# Altium project VXR7200_Bridge.PrjPcb (part 1 of 2)
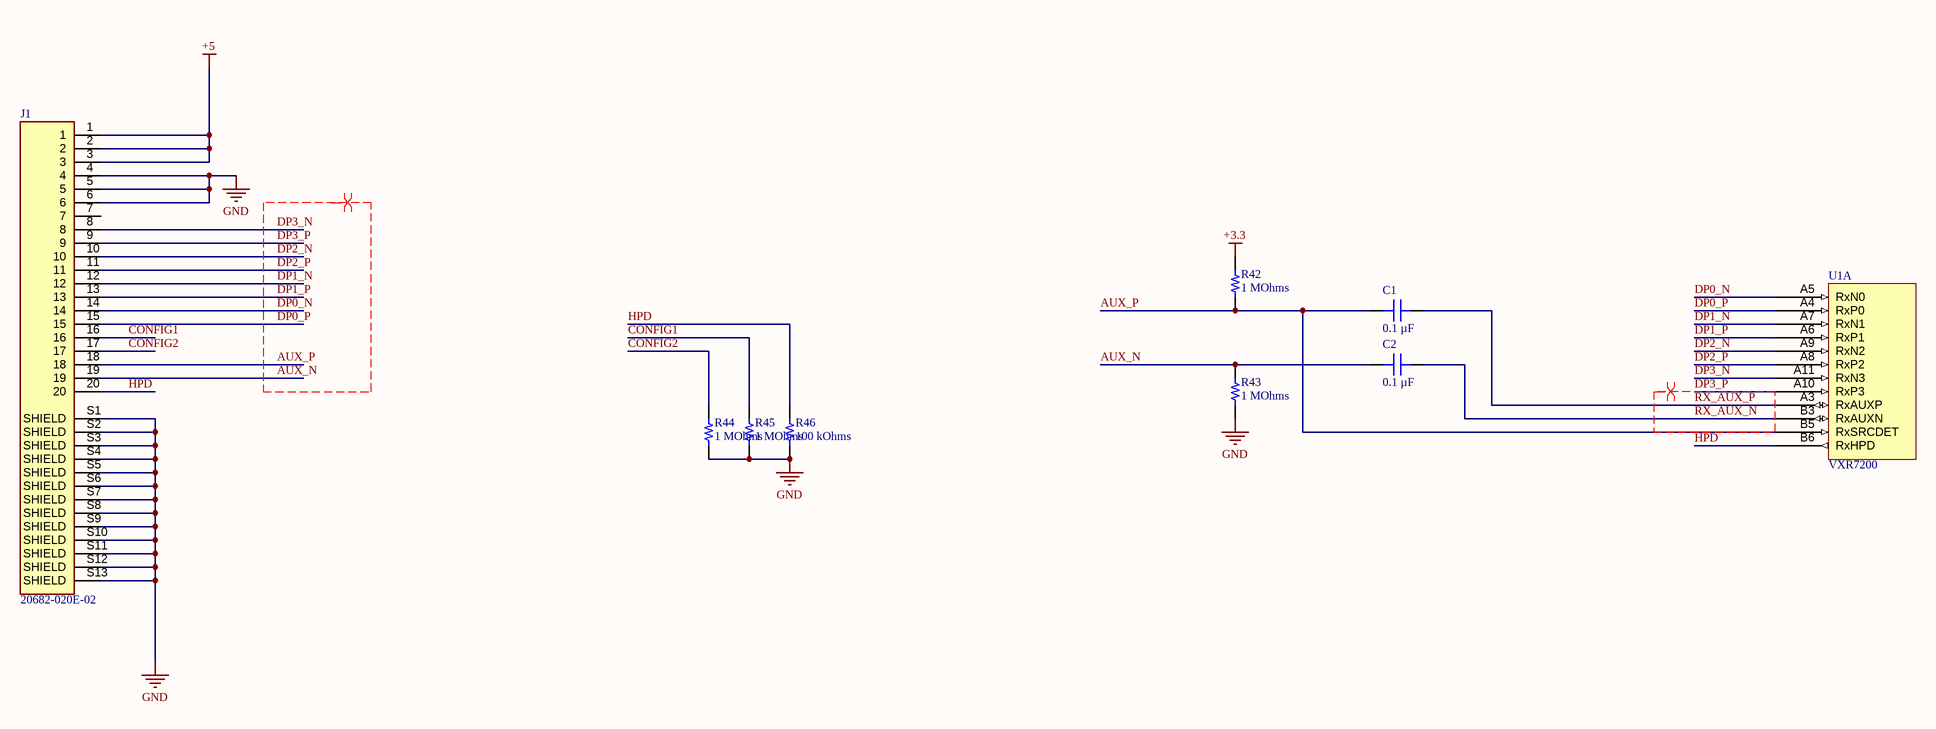
[diagram p0: RX_DP.SchDoc]
8 sheets, 118 parts. Net scope: flat (ports and power ports of the same name join across sheets).
Board file: PCB.PcbDoc
Sheets:
  RX_DP.SchDoc
  TX0.SchDoc
  TX1.SchDoc
  PDN.SchDoc
  Control.SchDoc
  Supplies_LTM4643.SchDoc
  Misc.SchDoc
  MCUConn.SchDoc

## Sheet RX_DP.SchDoc
size 431 x 279 mm; Organization: ORGANIZATION; Address1: ADDRESS 1; Address2: ADDRESS 2; Address3: ADDRESS 3; Address4: ADDRESS 4; Revision: -; SheetNumber: 1; SheetTotal: 8; ENG_APP_DATE: --/--/--; DSN_APP_DATE: --/--/--; CHK_APP_DATE: --/--/--

### Parts
C1  0.1 µF  [CAP 0201_0603]
C2  0.1 µF  [CAP 0201_0603]
J1  20682-020E-02  [IPEX_20682-020E-02]
R42  1 MOhms  [RES 0201_0603]
R43  1 MOhms  [RES 0201_0603]
R44  1 MOhms  [RES 0201_0603]
R45  1 MOhms  [RES 0201_0603]
R46  100 kOhms  [RES 0201_0603]
U1  VXR7200  [BGA100P9X9-81A]  (part A of 9)

### Nets
+3.3: R42.2
+5: J1.1 J1.2 J1.3
GND: J1.4 J1.5 J1.6 J1.S1(SHIELD) J1.S2(SHIELD) J1.S3(SHIELD) J1.S4(SHIELD) J1.S5(SHIELD) J1.S6(SHIELD) J1.S7(SHIELD) J1.S8(SHIELD) J1.S9(SHIELD) J1.S10(SHIELD) J1.S11(SHIELD) J1.S12(SHIELD) J1.S13(SHIELD) R43.1 R44.1 R45.1 R46.1
AUX_N: C2.1 J1.19 R43.2
AUX_P: C1.1 J1.18 R42.1 U1.B5(RxSRCDET)
CONFIG1: J1.16 R45.2
CONFIG2: J1.17 R44.2
DP0_N: J1.14 U1.A5(RxN0)
DP0_P: J1.15 U1.A4(RxP0)
DP1_N: J1.12 U1.A7(RxN1)
DP1_P: J1.13 U1.A6(RxP1)
DP2_N: J1.10 U1.A9(RxN2)
DP2_P: J1.11 U1.A8(RxP2)
DP3_N: J1.8 U1.A11(RxN3)
DP3_P: J1.9 U1.A10(RxP3)
HPD: J1.20 R46.2 U1.B6(RxHPD)
RX_AUX_N: C2.2 U1.B3(RxAUXN)
RX_AUX_P: C1.2 U1.A3(RxAUXP)

Not connected (* = marked no-connect by the designer): J1 7

### Layout directives
differential pair; net class DP; differential pair class DP: AUX_N, AUX_P, DP0_N, DP0_P, DP1_N, DP1_P, DP2_N, DP2_P, DP3_N, DP3_P, RX_AUX_N, RX_AUX_P

### Notes on the sheet
- DWG. NO.
- REV.
- SHT.
- REVISION
- DESCRIPTION
- DATE
- APPROVED
- ENG:
- APPROVALS
- PROJECT
- DSN:
- CHK:
- REFERENCE DOCUMENTS
- PROJECT REVISION:
- TITLE
- SimulaVR
- DOCUMENT REVISION:
- DESIGN ITEM:
- BOM:
- FAB DWG:
- PCB DWG:
- ASSY DWG:
- SCALE:
- SIZE
- B
- CAGE CODE
- FILE NAME
- DWG NO.
- SHEET
- OF
- REV

### Library data of the parts
C1 C2 = GRM033R61E104KE14D: CAP CER 0.1UF 25V X5R 0201; manufacturer: Murata Electronics; Tolerance: ±10%; Part Number: GRM033R61E104KE14D; Value: 0.1 µF; Applications: General Purpose; Capacitance: 0.1 µF; componentlink1description: Datasheet; componentlink1url: https://search.murata.co.jp/Ceramy/image/img/A01X/G101/ENG/GRM033R61E104KE14-01.pdf; componentlink2description: DigiKey Link; componentlink2url: https://www.digikey.com/en/products/detail/murata-electronics/GRM033R61E104KE14D/4904731; Device Package: 0201 (0603 Metric); lastupdated: 5/20/2022 2:33:00 PM; Lifecycle Status: Active; Minimum Order: 1; Mounting Type: Surface Mount; Operating Temperature: -55°C ~ 85°C; Package / Case: 0201 (0603 Metric); packaging: TapeAndReel; partid: 39731; Part Status: Active; price: 0.01; series: GRM; Size / Dimension: 0.024" L x 0.012" W (0.60mm x 0.30mm); Supplier 1: DigiKey; Supplier Part Number 1: 490-12686-1-ND; Temperature Coefficient: X5R; Thickness (Max): 0.013" (0.33mm); Voltage - Rated: 25V
J1 = 20682-020E-02: Cabline-CAII Rece. Ass'y; MF: {'manufacturer': u'I-PEX'}; Package: None; Price: None; MP: 20682-020E-02; Availability: Unavailable; Value: *
R42-R45 = CRCW02011M00FKED: RES SMD 1M OHM 1% 1/20W 0201; Manufacturer: Vishay Dale; Power (Watts): 0.05W, 1/20W; Temperature Coefficient: ±100ppm/°C; Part Number: CRCW02011M00FKED; Value: 1 MOhms; ComponentLink1Description: Datasheet; ComponentLink1URL: http://www.vishay.com/docs/20052/crcw0201e3.pdf; ComponentLink2Description: DigiKey Link; ComponentLink2URL: https://www.digikey.com/en/products/detail/vishay-dale/CRCW02011M00FKED/1968003; Composition: Thick Film; Device Package: 0201 (0603 Metric); Height - Seated (Max): 0.010" (0.26mm); LastUpdated: 2022-04-12 22:16:01; Lifecycle Status: Active; Minimum Order: 1; Number of Terminations: 2; Operating Temperature: -55°C ~ 155°C; Package / Case: 0201 (0603 Metric); Packaging: TapeAndReel; PartId: 30; Part Status: Active; Price: 0.03; Resistance: 1 MOhms; Series: CRCW; Size / Dimension: 0.024" L x 0.012" W (0.60mm x 0.30mm); Supplier 1: DigiKey; Supplier Part Number 1: 541-1.00MAABCT-ND; Supplier Device Package: 0201; Tolerance: ±1%
R46 = ERJ-U01F1003C: RES 100K OHM 1% 1/20W 0201 SMD; Manufacturer: Panasonic Electronic Components; Power (Watts): 0.05W, 1/20W; Temperature Coefficient: ±200ppm/°C; Part Number: ERJ-U01F1003C; Value: 100 kOhms; ComponentLink1Description: Datasheet; ComponentLink1URL: https://industrial.panasonic.com/cdbs/www-data/pdf/RDP0000/AOA0000C334.pdf; ComponentLink2Description: DigiKey Link; ComponentLink2URL: https://www.digikey.com/en/products/detail/panasonic-electronic-components/ERJ-U01F1003C/11631500; Composition: Thick Film; Device Package: 0201 (0603 Metric); Features: Anti-Sulfur; Height - Seated (Max): 0.010" (0.26mm); LastUpdated: 2022-04-12 22:15:26; Lifecycle Status: Active; Minimum Order: 1; Number of Terminations: 2; Operating Temperature: -55°C ~ 125°C; Package / Case: 0201 (0603 Metric); Packaging: TapeAndReel; PartId: 64617; Part Status: Active; Price: 0.05; Resistance: 100 kOhms; Series: ERJ-U01; Size / Dimension: 0.024" L x 0.012" W (0.60mm x 0.30mm); Supplier 1: DigiKey; Supplier Part Number 1: 10-ERJ-U01F1003CCT-ND; Supplier Device Package: 0201; Tolerance: ±1%
U1 = CMP-015-00008-4: VXR7200 DP to MIPI-DSI bridge

## Sheet TX0.SchDoc
size 431 x 279 mm; Organization: ORGANIZATION; Address1: ADDRESS 1; Address2: ADDRESS 2; Address3: ADDRESS 3; Address4: ADDRESS 4; Revision: -; SheetNumber: 2; SheetTotal: 8; ENG_APP_DATE: --/--/--; DSN_APP_DATE: --/--/--; CHK_APP_DATE: --/--/--
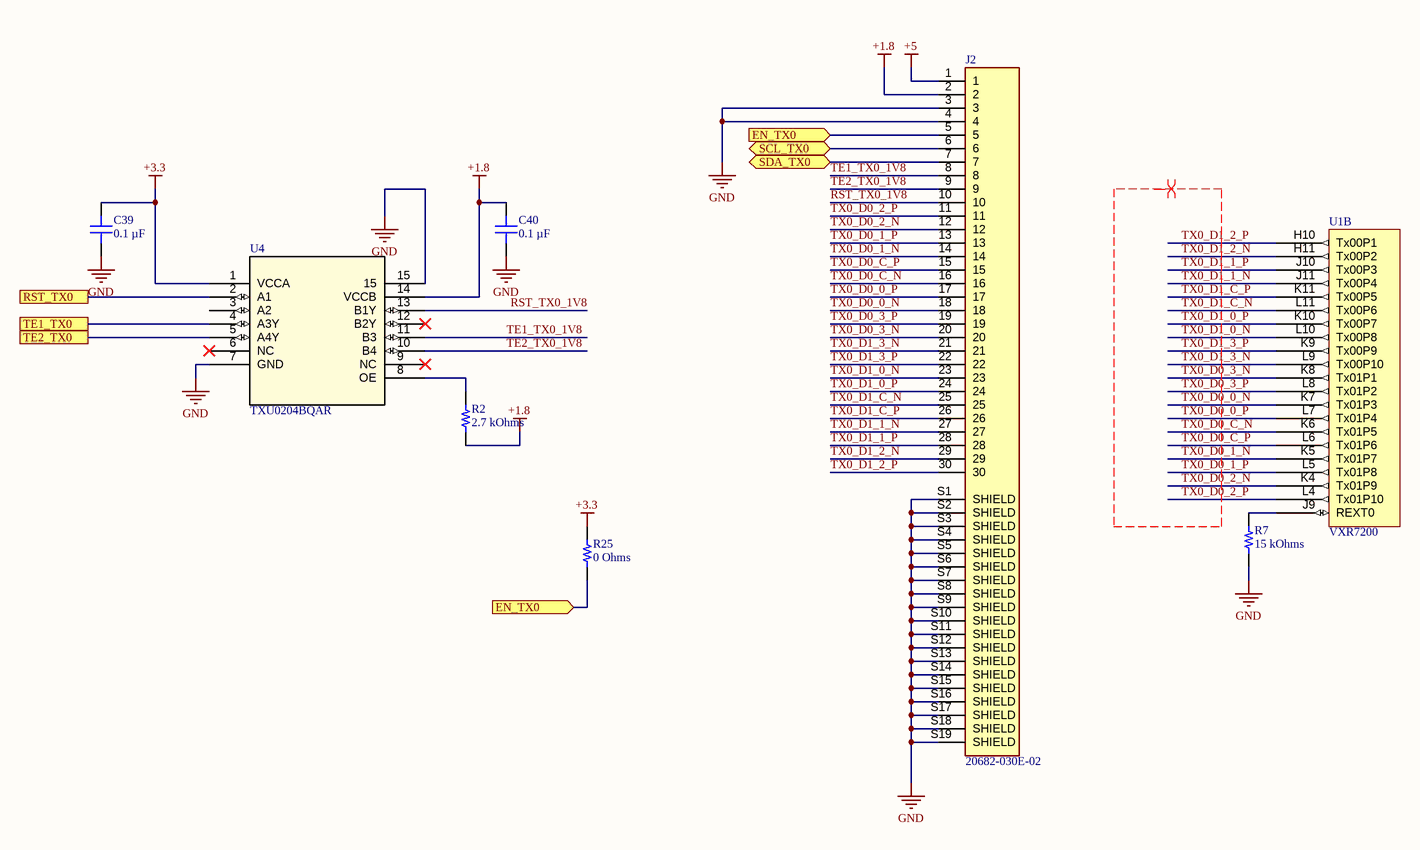
[diagram p1: TX0.SchDoc]

### Parts
C39  0.1 µF  [CAP 0201_0603]
C40  0.1 µF  [CAP 0201_0603]
J2  20682-030E-02  [IPEX_20682-030E-02]
R2  2.7 kOhms  [RES 0201_0603]
R7  15 kOhms  [RES 0201_0603]
R25  0 Ohms  [RES 0402_1005]
U1  VXR7200  [BGA100P9X9-81A]  (part B of 9)
U4  TXU0204BQAR  [WQFN_04BQAR_TEX]

### Ports
EN_TX0 (in), RST_TX0, SCL_TX0 (bidir), SDA_TX0 (bidir), TE1_TX0, TE2_TX0

### Nets
+1.8: C40.2 J2.2 R2.1 U4.14(VCCB)
+3.3: C39.2 R25.2 U4.1(VCCA)
+5: J2.1
GND: C39.1 C40.1 J2.3 J2.4 J2.S1(SHIELD) J2.S2(SHIELD) J2.S3(SHIELD) J2.S4(SHIELD) J2.S5(SHIELD) J2.S6(SHIELD) J2.S7(SHIELD) J2.S8(SHIELD) J2.S9(SHIELD) J2.S10(SHIELD) J2.S11(SHIELD) J2.S12(SHIELD) J2.S13(SHIELD) J2.S14(SHIELD) J2.S15(SHIELD) J2.S16(SHIELD) J2.S17(SHIELD) J2.S18(SHIELD) J2.S19(SHIELD) R7.1 U4.7(GND) U4.15
EN_TX0: J2.5 R25.1 ; port EN_TX0
RST_TX0: U4.2(A1) ; port RST_TX0
RST_TX0_1V8: J2.10 U4.13(B1Y)
SCL_TX0: J2.6 ; port SCL_TX0
SDA_TX0: J2.7 ; port SDA_TX0
TE1_TX0: U4.4(A3Y) ; port TE1_TX0
TE1_TX0_1V8: J2.8 U4.11(B3)
TE2_TX0: U4.5(A4Y) ; port TE2_TX0
TE2_TX0_1V8: J2.9 U4.10(B4)
TX0_D0_0_N: J2.18 U1.K7(Tx01P3)
TX0_D0_0_P: J2.17 U1.L7(Tx01P4)
TX0_D0_1_N: J2.14 U1.K5(Tx01P7)
TX0_D0_1_P: J2.13 U1.L5(Tx01P8)
TX0_D0_2_N: J2.12 U1.K4(Tx01P9)
TX0_D0_2_P: J2.11 U1.L4(Tx01P10)
TX0_D0_3_N: J2.20 U1.K8(Tx01P1)
TX0_D0_3_P: J2.19 U1.L8(Tx01P2)
TX0_D0_C_N: J2.16 U1.K6(Tx01P5)
TX0_D0_C_P: J2.15 U1.L6(Tx01P6)
TX0_D1_0_N: J2.23 U1.L10(Tx00P8)
TX0_D1_0_P: J2.24 U1.K10(Tx00P7)
TX0_D1_1_N: J2.27 U1.J11(Tx00P4)
TX0_D1_1_P: J2.28 U1.J10(Tx00P3)
TX0_D1_2_N: J2.29 U1.H11(Tx00P2)
TX0_D1_2_P: J2.30 U1.H10(Tx00P1)
TX0_D1_3_N: J2.21 U1.L9(Tx00P10)
TX0_D1_3_P: J2.22 U1.K9(Tx00P9)
TX0_D1_C_N: J2.25 U1.L11(Tx00P6)
TX0_D1_C_P: J2.26 U1.K11(Tx00P5)
NetR2_2: R2.2 U4.8(OE)
NetR7_2: R7.2 U1.J9(REXT0)

Not connected (* = marked no-connect by the designer): U4 3(A2) 6(NC)* 9(NC)* 12(B2Y)*

### Layout directives
differential pair; net class MIPI; differential pair class MIPI: TX0_D0_0_N, TX0_D0_0_P, TX0_D0_1_N, TX0_D0_1_P, TX0_D0_2_N, TX0_D0_2_P, TX0_D0_3_N, TX0_D0_3_P, TX0_D0_C_N, TX0_D0_C_P, TX0_D1_0_N, TX0_D1_0_P, TX0_D1_1_N, TX0_D1_1_P, TX0_D1_2_N, TX0_D1_2_P, TX0_D1_3_N, TX0_D1_3_P, TX0_D1_C_N, TX0_D1_C_P

### Notes on the sheet
- DWG. NO.
- REV.
- SHT.
- REVISION
- DESCRIPTION
- DATE
- APPROVED
- ENG:
- APPROVALS
- PROJECT
- DSN:
- CHK:
- REFERENCE DOCUMENTS
- PROJECT REVISION:
- TITLE
- SimulaVR
- DOCUMENT REVISION:
- DESIGN ITEM:
- BOM:
- FAB DWG:
- PCB DWG:
- ASSY DWG:
- SCALE:
- SIZE
- B
- CAGE CODE
- FILE NAME
- DWG NO.
- SHEET
- OF
- REV

### Library data of the parts
C39 C40 = GRM033R61E104KE14D: as C1 on sheet RX_DP; Part Number: GRM033R61E104KE14D; Value: 0.1 µF; Applications: General Purpose; Capacitance: 0.1 µF; componentlink1description: Datasheet; componentlink1url: https://search.murata.co.jp/Ceramy/image/img/A01X/G101/ENG/GRM033R61E104KE14-01.pdf; componentlink2description: DigiKey Link; componentlink2url: https://www.digikey.com/en/products/detail/murata-electronics/GRM033R61E104KE14D/4904731; Device Package: 0201 (0603 Metric); lastupdated: 5/20/2022 2:33:00 PM; Lifecycle Status: Active; Minimum Order: 1; Mounting Type: Surface Mount; Operating Temperature: -55°C ~ 85°C; Package / Case: 0201 (0603 Metric); packaging: TapeAndReel; partid: 39731; Part Status: Active; price: 0.01; series: GRM; Size / Dimension: 0.024" L x 0.012" W (0.60mm x 0.30mm); Supplier 1: DigiKey; Supplier Part Number 1: 490-12686-1-ND; Temperature Coefficient: X5R; Thickness (Max): 0.013" (0.33mm); Voltage - Rated: 25V
J2 = 20682-030E-02: Cabline-CAII Rece. Ass'y; MF: {'manufacturer': u'I-PEX'}; Value: *; Availability: Unavailable; Price: None; Package: None; MP: 20682-030E-02
R2 = ERJ-U01J272C: RES 2.7K OHM 5% 1/20W 0201 SMD; Manufacturer: Panasonic Electronic Components; Power (Watts): 0.05W, 1/20W; Temperature Coefficient: ±200ppm/°C; Part Number: ERJ-U01J272C; Value: 2.7 kOhms; ComponentLink1Description: Datasheet; ComponentLink1URL: https://industrial.panasonic.com/cdbs/www-data/pdf/RDP0000/AOA0000C334.pdf; ComponentLink2Description: DigiKey Link; ComponentLink2URL: https://www.digikey.com/en/products/detail/panasonic-electronic-components/ERJ-U01J272C/11641374; Composition: Thick Film; Device Package: 0201 (0603 Metric); Features: Anti-Sulfur; Height - Seated (Max): 0.010" (0.26mm); LastUpdated: 2022-04-12 22:15:26; Lifecycle Status: Active; Minimum Order: 1; Number of Terminations: 2; Operating Temperature: -55°C ~ 125°C; Package / Case: 0201 (0603 Metric); Packaging: TapeAndReel; PartId: 64645; Part Status: Active; Price: 0.04; Resistance: 2.7 kOhms; Series: ERJ-U01; Size / Dimension: 0.024" L x 0.012" W (0.60mm x 0.30mm); Supplier 1: DigiKey; Supplier Part Number 1: 10-ERJ-U01J272CCT-ND; Supplier Device Package: 0201; Tolerance: ±5%
R7 = ERJ-1GNF1502C: RES SMD 15K OHM 1% 1/20W 0201; Manufacturer: Panasonic Electronic Components; Power (Watts): 0.05W, 1/20W; Temperature Coefficient: ±200ppm/°C; Part Number: ERJ-1GNF1502C; Value: 15 kOhms; ComponentLink1Description: Datasheet; ComponentLink1URL: https://industrial.panasonic.com/cdbs/www-data/pdf/RDA0000/AOA0000C304.pdf; ComponentLink2Description: DigiKey Link; ComponentLink2URL: https://www.digikey.com/en/products/detail/panasonic-electronic-components/ERJ-1GNF1502C/2036244; Composition: Thick Film; Device Package: 0201 (0603 Metric); Features: Automotive AEC-Q200; Height - Seated (Max): 0.010" (0.26mm); LastUpdated: 2022-05-10 16:40:15; Lifecycle Status: Active; Minimum Order: 1; Number of Terminations: 2; Operating Temperature: -55°C ~ 125°C; Package / Case: 0201 (0603 Metric); Packaging: TapeAndReel; PartId: 3474; Part Status: Active; Price: 0.01; Ratings: AEC-Q200; Resistance: 15 kOhms; Series: ERJ-1GN; Size / Dimension: 0.024" L x 0.012" W (0.60mm x 0.30mm); Supplier 1: DigiKey; Supplier Part Number 1: P122744CT-ND; Supplier Device Package: 0201; Tolerance: ±1%
R25 = AC0402FR-070RL: RESISTOR 0402 JUMPER ZERO OHM; Manufacturer: Yageo; Power (Watts): 0.063W, 1/16W; Part Number: AC0402FR-070RL; Value: 0 Ohms; ComponentLink1Description: Datasheet; ComponentLink1URL: https://www.yageo.com/upload/media/product/productsearch/datasheet/rchip/PYu-AC_51_RoHS_L_8.pdf; ComponentLink2Description: DigiKey Link; ComponentLink2URL: https://www.digikey.com/en/products/detail/yageo/AC0402FR-070RL/12082398; Composition: Thick Film; Device Package: 0402 (1005 Metric); Features: Automotive AEC-Q200, Moisture Resistant; Height - Seated (Max): 0.015" (0.37mm); LastUpdated: 2022-04-12 22:19:37; Lifecycle Status: Active; Minimum Order: 1; Number of Terminations: 2; Operating Temperature: -55°C ~ 155°C; Package / Case: 0402 (1005 Metric); Packaging: CutTape; PartId: 66976; Part Status: Active; Price: 0.01; Ratings: AEC-Q200; Resistance: 0 Ohms; Series: AC; Size / Dimension: 0.039" L x 0.020" W (1.00mm x 0.50mm); Supplier 1: DigiKey; Supplier Part Number 1: 13-AC0402FR-070RLCT-ND; Supplier Device Package: 0402; Tolerance: Jumper
U1 = CMP-015-00008-4: VXR7200 DP to MIPI-DSI bridge
U4 = CMP-006-000001-1: No Description Available; Mfr_Name: Texas Instruments; Design Item ID: TXU0204BQAR; RefDes: RefDes; Copyright: Copyright (C) 2022 Ultra Librarian. All rights reserved.; Type: DEV; Manufacturer_Part_Number: TXU0204BQAR; Source: TXU0204BQAR.SchLib

## Sheet TX1.SchDoc
size 431 x 279 mm; Organization: ORGANIZATION; Address1: ADDRESS 1; Address2: ADDRESS 2; Address3: ADDRESS 3; Address4: ADDRESS 4; Revision: -; SheetNumber: 3; SheetTotal: 8; ENG_APP_DATE: --/--/--; DSN_APP_DATE: --/--/--; CHK_APP_DATE: --/--/--
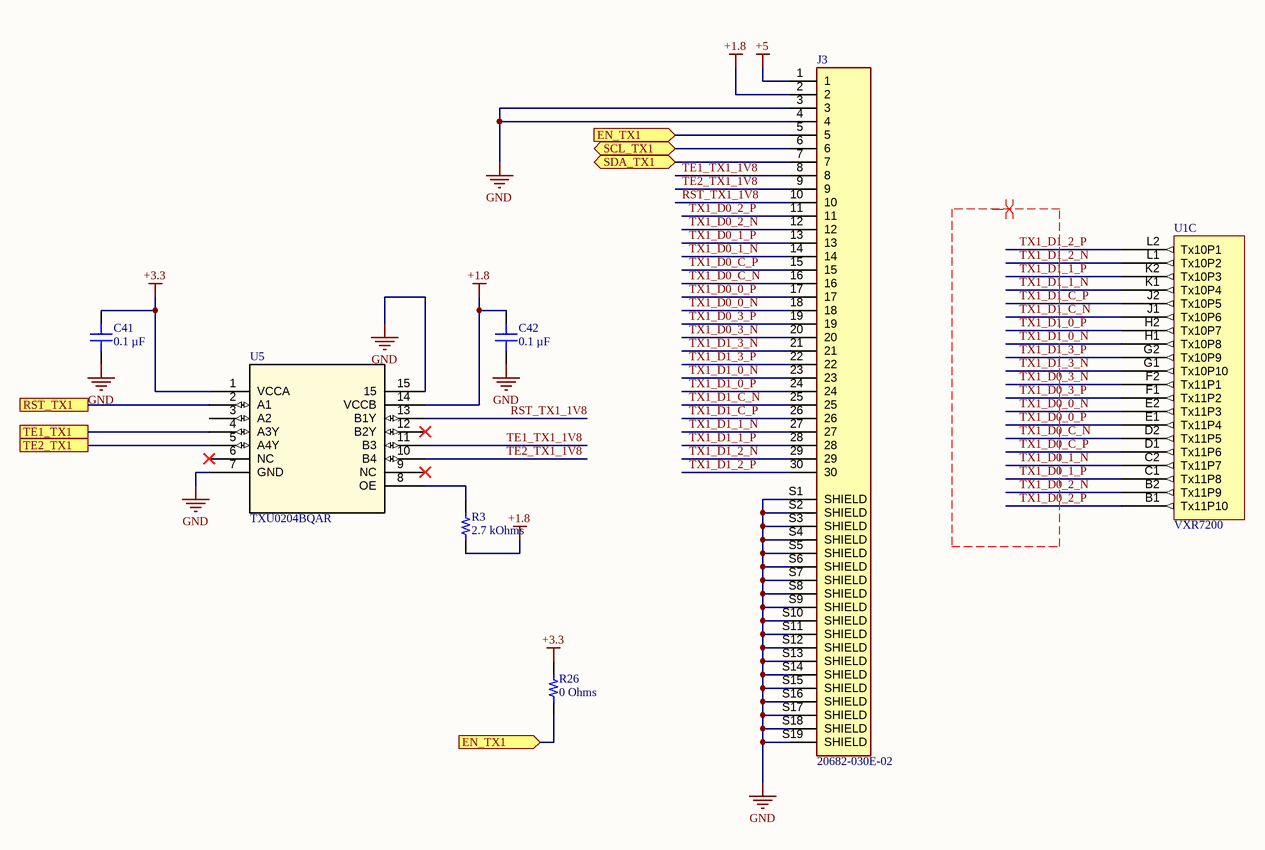
[diagram p2: TX1.SchDoc]

### Parts
C41  0.1 µF  [CAP 0201_0603]
C42  0.1 µF  [CAP 0201_0603]
J3  20682-030E-02  [IPEX_20682-030E-02]
R3  2.7 kOhms  [RES 0201_0603]
R26  0 Ohms  [RES 0402_1005]
U1  VXR7200  [BGA100P9X9-81A]  (part C of 9)
U5  TXU0204BQAR  [WQFN_04BQAR_TEX]

### Ports
EN_TX1 (in), RST_TX1, SCL_TX1 (bidir), SDA_TX1 (bidir), TE1_TX1, TE2_TX1

### Nets
+1.8: C42.2 J3.2 R3.1 U5.14(VCCB)
+3.3: C41.2 R26.2 U5.1(VCCA)
+5: J3.1
GND: C41.1 C42.1 J3.3 J3.4 J3.S1(SHIELD) J3.S2(SHIELD) J3.S3(SHIELD) J3.S4(SHIELD) J3.S5(SHIELD) J3.S6(SHIELD) J3.S7(SHIELD) J3.S8(SHIELD) J3.S9(SHIELD) J3.S10(SHIELD) J3.S11(SHIELD) J3.S12(SHIELD) J3.S13(SHIELD) J3.S14(SHIELD) J3.S15(SHIELD) J3.S16(SHIELD) J3.S17(SHIELD) J3.S18(SHIELD) J3.S19(SHIELD) U5.7(GND) U5.15
EN_TX1: J3.5 R26.1 ; port EN_TX1
RST_TX1: U5.2(A1) ; port RST_TX1
RST_TX1_1V8: J3.10 U5.13(B1Y)
SCL_TX1: J3.6 ; port SCL_TX1
SDA_TX1: J3.7 ; port SDA_TX1
TE1_TX1: U5.4(A3Y) ; port TE1_TX1
TE1_TX1_1V8: J3.8 U5.11(B3)
TE2_TX1: U5.5(A4Y) ; port TE2_TX1
TE2_TX1_1V8: J3.9 U5.10(B4)
TX1_D0_0_N: J3.18 U1.E2(Tx11P3)
TX1_D0_0_P: J3.17 U1.E1(Tx11P4)
TX1_D0_1_N: J3.14 U1.C2(Tx11P7)
TX1_D0_1_P: J3.13 U1.C1(Tx11P8)
TX1_D0_2_N: J3.12 U1.B2(Tx11P9)
TX1_D0_2_P: J3.11 U1.B1(Tx11P10)
TX1_D0_3_N: J3.20 U1.F2(Tx11P1)
TX1_D0_3_P: J3.19 U1.F1(Tx11P2)
TX1_D0_C_N: J3.16 U1.D2(Tx11P5)
TX1_D0_C_P: J3.15 U1.D1(Tx11P6)
TX1_D1_0_N: J3.23 U1.H1(Tx10P8)
TX1_D1_0_P: J3.24 U1.H2(Tx10P7)
TX1_D1_1_N: J3.27 U1.K1(Tx10P4)
TX1_D1_1_P: J3.28 U1.K2(Tx10P3)
TX1_D1_2_N: J3.29 U1.L1(Tx10P2)
TX1_D1_2_P: J3.30 U1.L2(Tx10P1)
TX1_D1_3_N: J3.21 U1.G1(Tx10P10)
TX1_D1_3_P: J3.22 U1.G2(Tx10P9)
TX1_D1_C_N: J3.25 U1.J1(Tx10P6)
TX1_D1_C_P: J3.26 U1.J2(Tx10P5)
NetR3_2: R3.2 U5.8(OE)

Not connected (* = marked no-connect by the designer): U5 3(A2) 6(NC)* 9(NC)* 12(B2Y)*

### Layout directives
differential pair; net class MIPI; differential pair class MIPI: TX1_D0_0_N, TX1_D0_0_P, TX1_D0_1_N, TX1_D0_1_P, TX1_D0_2_N, TX1_D0_2_P, TX1_D0_3_N, TX1_D0_3_P, TX1_D0_C_N, TX1_D0_C_P, TX1_D1_0_N, TX1_D1_0_P, TX1_D1_1_N, TX1_D1_1_P, TX1_D1_2_N, TX1_D1_2_P, TX1_D1_3_N, TX1_D1_3_P, TX1_D1_C_N, TX1_D1_C_P

### Notes on the sheet
- DWG. NO.
- REV.
- SHT.
- REVISION
- DESCRIPTION
- DATE
- APPROVED
- ENG:
- APPROVALS
- PROJECT
- DSN:
- CHK:
- REFERENCE DOCUMENTS
- PROJECT REVISION:
- TITLE
- SimulaVR
- DOCUMENT REVISION:
- DESIGN ITEM:
- BOM:
- FAB DWG:
- PCB DWG:
- ASSY DWG:
- SCALE:
- SIZE
- B
- CAGE CODE
- FILE NAME
- DWG NO.
- SHEET
- OF
- REV

### Library data of the parts
C41 C42 = GRM033R61E104KE14D: as C1 on sheet RX_DP; Part Number: GRM033R61E104KE14D; Value: 0.1 µF; Applications: General Purpose; Capacitance: 0.1 µF; componentlink1description: Datasheet; componentlink1url: https://search.murata.co.jp/Ceramy/image/img/A01X/G101/ENG/GRM033R61E104KE14-01.pdf; componentlink2description: DigiKey Link; componentlink2url: https://www.digikey.com/en/products/detail/murata-electronics/GRM033R61E104KE14D/4904731; Device Package: 0201 (0603 Metric); lastupdated: 5/20/2022 2:33:00 PM; Lifecycle Status: Active; Minimum Order: 1; Mounting Type: Surface Mount; Operating Temperature: -55°C ~ 85°C; Package / Case: 0201 (0603 Metric); packaging: TapeAndReel; partid: 39731; Part Status: Active; price: 0.01; series: GRM; Size / Dimension: 0.024" L x 0.012" W (0.60mm x 0.30mm); Supplier 1: DigiKey; Supplier Part Number 1: 490-12686-1-ND; Temperature Coefficient: X5R; Thickness (Max): 0.013" (0.33mm); Voltage - Rated: 25V
J3 = 20682-030E-02: as J2 on sheet TX0; Value: *; Availability: Unavailable; Price: None; Package: None; MP: 20682-030E-02
R3 = ERJ-U01J272C: as R2 on sheet TX0; Part Number: ERJ-U01J272C; Value: 2.7 kOhms; ComponentLink1Description: Datasheet; ComponentLink1URL: https://industrial.panasonic.com/cdbs/www-data/pdf/RDP0000/AOA0000C334.pdf; ComponentLink2Description: DigiKey Link; ComponentLink2URL: https://www.digikey.com/en/products/detail/panasonic-electronic-components/ERJ-U01J272C/11641374; Composition: Thick Film; Device Package: 0201 (0603 Metric); Features: Anti-Sulfur; Height - Seated (Max): 0.010" (0.26mm); LastUpdated: 2022-04-12 22:15:26; Lifecycle Status: Active; Minimum Order: 1; Number of Terminations: 2; Operating Temperature: -55°C ~ 125°C; Package / Case: 0201 (0603 Metric); Packaging: TapeAndReel; PartId: 64645; Part Status: Active; Price: 0.04; Resistance: 2.7 kOhms; Series: ERJ-U01; Size / Dimension: 0.024" L x 0.012" W (0.60mm x 0.30mm); Supplier 1: DigiKey; Supplier Part Number 1: 10-ERJ-U01J272CCT-ND; Supplier Device Package: 0201; Tolerance: ±5%
R26 = AC0402FR-070RL: as R25 on sheet TX0; Part Number: AC0402FR-070RL; Value: 0 Ohms; ComponentLink1Description: Datasheet; ComponentLink1URL: https://www.yageo.com/upload/media/product/productsearch/datasheet/rchip/PYu-AC_51_RoHS_L_8.pdf; ComponentLink2Description: DigiKey Link; ComponentLink2URL: https://www.digikey.com/en/products/detail/yageo/AC0402FR-070RL/12082398; Composition: Thick Film; Device Package: 0402 (1005 Metric); Features: Automotive AEC-Q200, Moisture Resistant; Height - Seated (Max): 0.015" (0.37mm); LastUpdated: 2022-04-12 22:19:37; Lifecycle Status: Active; Minimum Order: 1; Number of Terminations: 2; Operating Temperature: -55°C ~ 155°C; Package / Case: 0402 (1005 Metric); Packaging: CutTape; PartId: 66976; Part Status: Active; Price: 0.01; Ratings: AEC-Q200; Resistance: 0 Ohms; Series: AC; Size / Dimension: 0.039" L x 0.020" W (1.00mm x 0.50mm); Supplier 1: DigiKey; Supplier Part Number 1: 13-AC0402FR-070RLCT-ND; Supplier Device Package: 0402; Tolerance: Jumper
U1 = CMP-015-00008-4: VXR7200 DP to MIPI-DSI bridge
U5 = CMP-006-000001-1: as U4 on sheet TX0; Design Item ID: TXU0204BQAR; RefDes: RefDes; Copyright: Copyright (C) 2022 Ultra Librarian. All rights reserved.; Type: DEV; Manufacturer_Part_Number: TXU0204BQAR; Source: TXU0204BQAR.SchLib

## Sheet PDN.SchDoc
size 431 x 279 mm; Organization: ORGANIZATION; Address1: ADDRESS 1; Address2: ADDRESS 2; Address3: ADDRESS 3; Address4: ADDRESS 4; Revision: -; SheetNumber: 4; SheetTotal: 8; ENG_APP_DATE: --/--/--; DSN_APP_DATE: --/--/--; CHK_APP_DATE: --/--/--
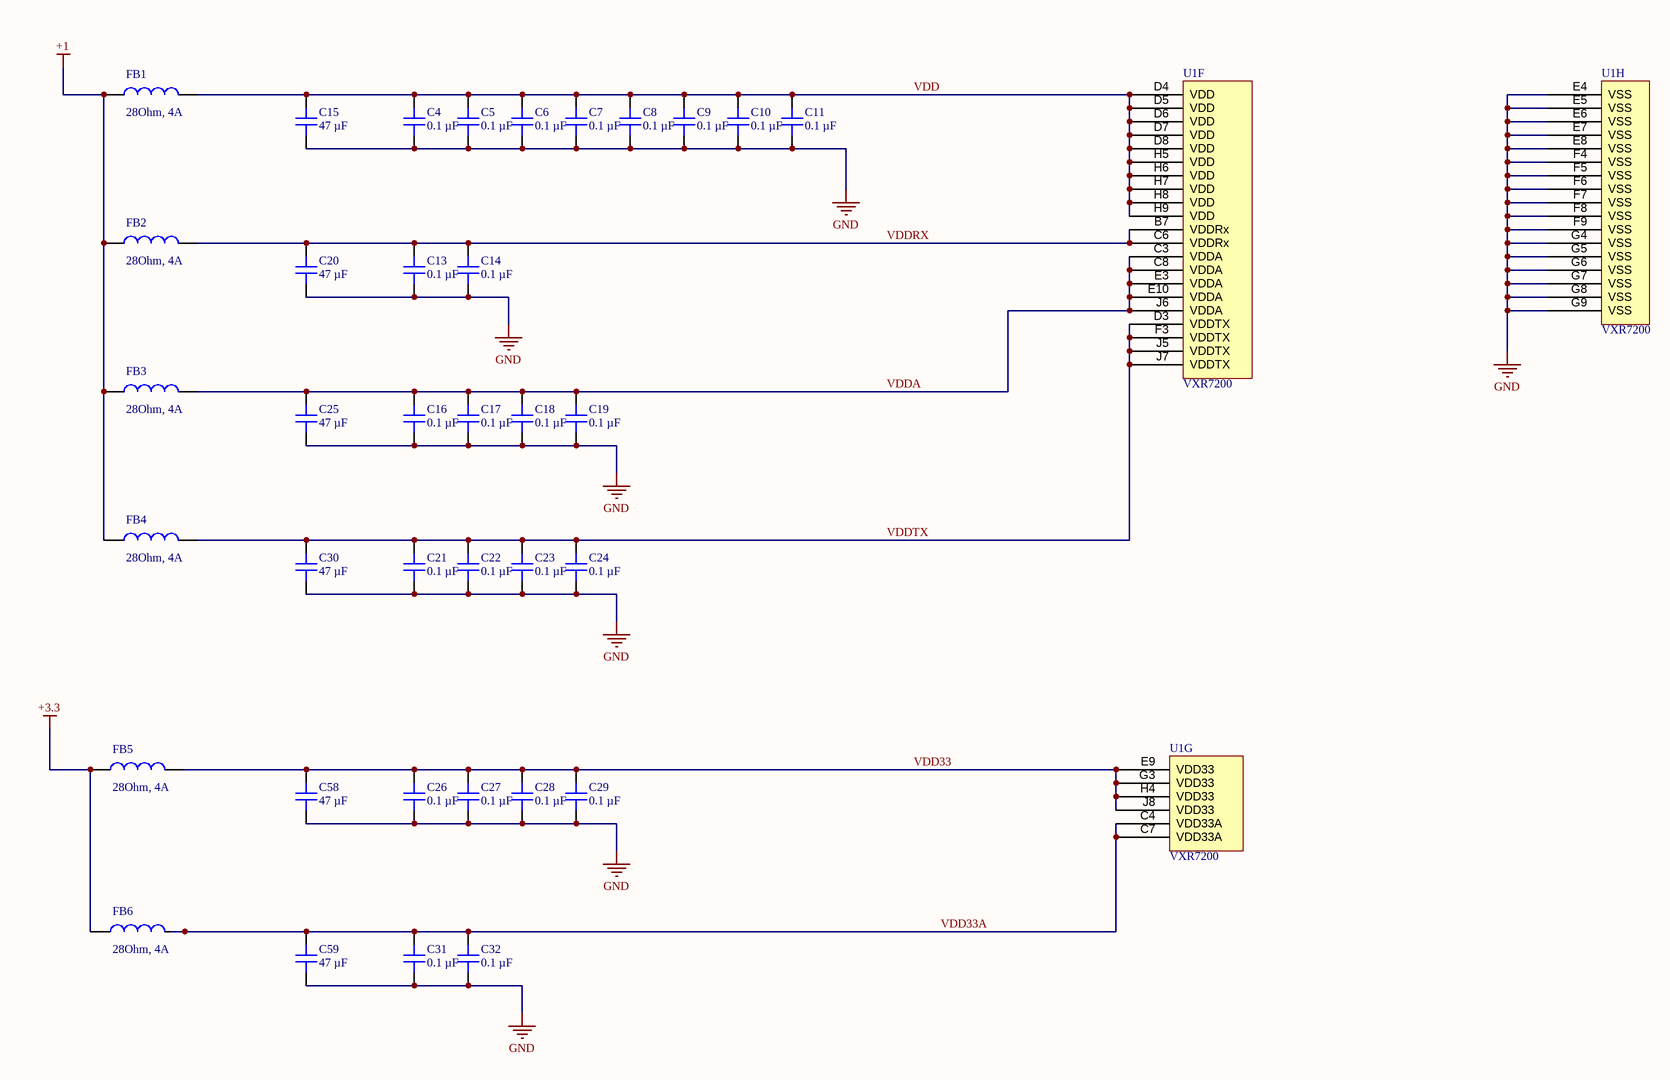
[diagram p3: PDN.SchDoc]

### Parts
C4  0.1 µF  [CAP 0201_0603]
C5  0.1 µF  [CAP 0201_0603]
C6  0.1 µF  [CAP 0201_0603]
C7  0.1 µF  [CAP 0201_0603]
C8  0.1 µF  [CAP 0201_0603]
C9  0.1 µF  [CAP 0201_0603]
C10  0.1 µF  [CAP 0201_0603]
C11  0.1 µF  [CAP 0201_0603]
C13  0.1 µF  [CAP 0201_0603]
C14  0.1 µF  [CAP 0201_0603]
C15  47 µF  [CAP 0603_1608]
C16  0.1 µF  [CAP 0201_0603]
C17  0.1 µF  [CAP 0201_0603]
C18  0.1 µF  [CAP 0201_0603]
C19  0.1 µF  [CAP 0201_0603]
C20  47 µF  [CAP 0603_1608]
C21  0.1 µF  [CAP 0201_0603]
C22  0.1 µF  [CAP 0201_0603]
C23  0.1 µF  [CAP 0201_0603]
C24  0.1 µF  [CAP 0201_0603]
C25  47 µF  [CAP 0603_1608]
C26  0.1 µF  [CAP 0201_0603]
C27  0.1 µF  [CAP 0201_0603]
C28  0.1 µF  [CAP 0201_0603]
C29  0.1 µF  [CAP 0201_0603]
C30  47 µF  [CAP 0603_1608]
C31  0.1 µF  [CAP 0201_0603]
C32  0.1 µF  [CAP 0201_0603]
C58  47 µF  [CAP 0603_1608]
C59  47 µF  [CAP 0603_1608]
FB1  28Ohm, 4A  [WE-CBF_0603_High Current]
FB2  28Ohm, 4A  [WE-CBF_0603_High Current]
FB3  28Ohm, 4A  [WE-CBF_0603_High Current]
FB4  28Ohm, 4A  [WE-CBF_0603_High Current]
FB5  28Ohm, 4A  [WE-CBF_0603_High Current]
FB6  28Ohm, 4A  [WE-CBF_0603_High Current]
U1  VXR7200  [BGA100P9X9-81A]  (parts F,G,H of 9)

### Nets
+1: FB1.1 FB2.1 FB3.1 FB4.1
+3.3: FB5.1 FB6.1
GND: C4.1 C5.1 C6.1 C7.1 C8.1 C9.1 C10.1 C11.1 C13.1 C14.1 C15.1 C16.1 C17.1 C18.1 C19.1 C20.1 C21.1 C22.1 C23.1 C24.1 C25.1 C26.1 C27.1 C28.1 C29.1 C30.1 C31.1 C32.1 C58.1 C59.1 U1.E4(VSS) U1.E5(VSS) U1.E6(VSS) U1.E7(VSS) U1.E8(VSS) U1.F4(VSS) U1.F5(VSS) U1.F6(VSS) U1.F7(VSS) U1.F8(VSS) U1.F9(VSS) U1.G4(VSS) U1.G5(VSS) U1.G6(VSS) U1.G7(VSS) U1.G8(VSS) U1.G9(VSS)
VDD: C4.2 C5.2 C6.2 C7.2 C8.2 C9.2 C10.2 C11.2 C15.2 FB1.2 U1.D4(VDD) U1.D5(VDD) U1.D6(VDD) U1.D7(VDD) U1.D8(VDD) U1.H5(VDD) U1.H6(VDD) U1.H7(VDD) U1.H8(VDD) U1.H9(VDD)
VDD33: C26.2 C27.2 C28.2 C29.2 C58.2 FB5.2 U1.E9(VDD33) U1.G3(VDD33) U1.H4(VDD33) U1.J8(VDD33)
VDD33A: C31.2 C32.2 C59.2 FB6.2 U1.C4(VDD33A) U1.C7(VDD33A)
VDDA: C16.2 C17.2 C18.2 C19.2 C25.2 FB3.2 U1.C3(VDDA) U1.C8(VDDA) U1.E3(VDDA) U1.E10(VDDA) U1.J6(VDDA)
VDDRX: C13.2 C14.2 C20.2 FB2.2 U1.B7(VDDRx) U1.C6(VDDRx)
VDDTX: C21.2 C22.2 C23.2 C24.2 C30.2 FB4.2 U1.D3(VDDTX) U1.F3(VDDTX) U1.J5(VDDTX) U1.J7(VDDTX)

### Notes on the sheet
- DWG. NO.
- REV.
- SHT.
- REVISION
- DESCRIPTION
- DATE
- APPROVED
- ENG:
- APPROVALS
- PROJECT
- DSN:
- CHK:
- REFERENCE DOCUMENTS
- PROJECT REVISION:
- TITLE
- SimulaVR
- DOCUMENT REVISION:
- DESIGN ITEM:
- BOM:
- FAB DWG:
- PCB DWG:
- ASSY DWG:
- SCALE:
- SIZE
- B
- CAGE CODE
- FILE NAME
- DWG NO.
- SHEET
- OF
- REV

### Library data of the parts
C4-C11 C13 C14 C16-C19 C21-C24 C26-C29 C31 C32 = GRM033R61E104KE14D: as C1 on sheet RX_DP; Part Number: GRM033R61E104KE14D; Value: 0.1 µF; Applications: General Purpose; Capacitance: 0.1 µF; componentlink1description: Datasheet; componentlink1url: https://search.murata.co.jp/Ceramy/image/img/A01X/G101/ENG/GRM033R61E104KE14-01.pdf; componentlink2description: DigiKey Link; componentlink2url: https://www.digikey.com/en/products/detail/murata-electronics/GRM033R61E104KE14D/4904731; Device Package: 0201 (0603 Metric); lastupdated: 5/20/2022 2:33:00 PM; Lifecycle Status: Active; Minimum Order: 1; Mounting Type: Surface Mount; Operating Temperature: -55°C ~ 85°C; Package / Case: 0201 (0603 Metric); packaging: TapeAndReel; Part Status: Active; price: 0.01; series: GRM; Size / Dimension: 0.024" L x 0.012" W (0.60mm x 0.30mm); Supplier 1: DigiKey; Supplier Part Number 1: 490-12686-1-ND; Temperature Coefficient: X5R; Thickness (Max): 0.013" (0.33mm); Voltage - Rated: 25V; partid: 39731
C15 C20 C25 C30 C58 C59 = GRM188R60J476ME01D: CAP CER 47UF 6.3V X5R 0603; manufacturer: Murata Electronics; Tolerance: ±20%; Part Number: GRM188R60J476ME01D; Value: 47 µF; Applications: General Purpose; Capacitance: 47 µF; componentlink2description: DigiKey Link; componentlink2url: https://www.digikey.com/en/products/detail/murata-electronics/GRM188R60J476ME01D/13996874; Device Package: 0603 (1608 Metric); lastupdated: 5/20/2022 2:38:45 PM; Lifecycle Status: Active; Minimum Order: 1; Mounting Type: Surface Mount, MLCC; Operating Temperature: -55°C ~ 85°C; Package / Case: 0603 (1608 Metric); packaging: TapeAndReel; partid: 44498; Part Status: Active; price: 0.10; series: GRM; Size / Dimension: 0.063" L x 0.031" W (1.60mm x 0.80mm); Supplier 1: DigiKey; Supplier Part Number 1: 490-GRM188R60J476ME01DCT-ND; Temperature Coefficient: X5R; Thickness (Max): 0.039" (1.00mm); Voltage - Rated: 6.3V
FB1-FB6 = 742792603: WE-CBF SMT EMI Suppression Ferrite Bead, size 0603, 28Ohm, 4A; Manufacturer: Wurth Elektronik; Case/Size Code: 0603; Impedance Max: 45Ohm; Impedance Max Test Condition: 1000MHz; DC Resistance Max: 0.03Ohm; Type: High Current; Width: 0.8mm; Packaging: Tape and Reel; Height: 0.8mm; Length: 1.6mm; ComponentLink1Description: Manufacturer Link; ComponentLink1URL: http://www.we-online.de; ComponentLink2Description: Datasheet; ComponentLink2URL: https://www.we-online.com/catalog/datasheet/742792603.pdf; Manufacturer Part Number: 742792603; Mount: SMT; Operating Temperature Max: 125°C; Operating Temperature Min: -55°C; Category: Ferrites for PCB Assembly; Match Code: WE-CBF; Impedance @100MHz: 28Ohm; Rated Current: 4A
U1 = CMP-015-00008-4: VXR7200 DP to MIPI-DSI bridge

## Sheet Control.SchDoc
size 431 x 279 mm; Organization: ORGANIZATION; Address1: ADDRESS 1; Address2: ADDRESS 2; Address3: ADDRESS 3; Address4: ADDRESS 4; Revision: -; SheetNumber: 5; SheetTotal: 8; ENG_APP_DATE: --/--/--; DSN_APP_DATE: --/--/--; CHK_APP_DATE: --/--/--; SPICEModelCacheDZCMNMWT: <root> / <DocumentId>DZCMNMWT</DocumentId> / </root>
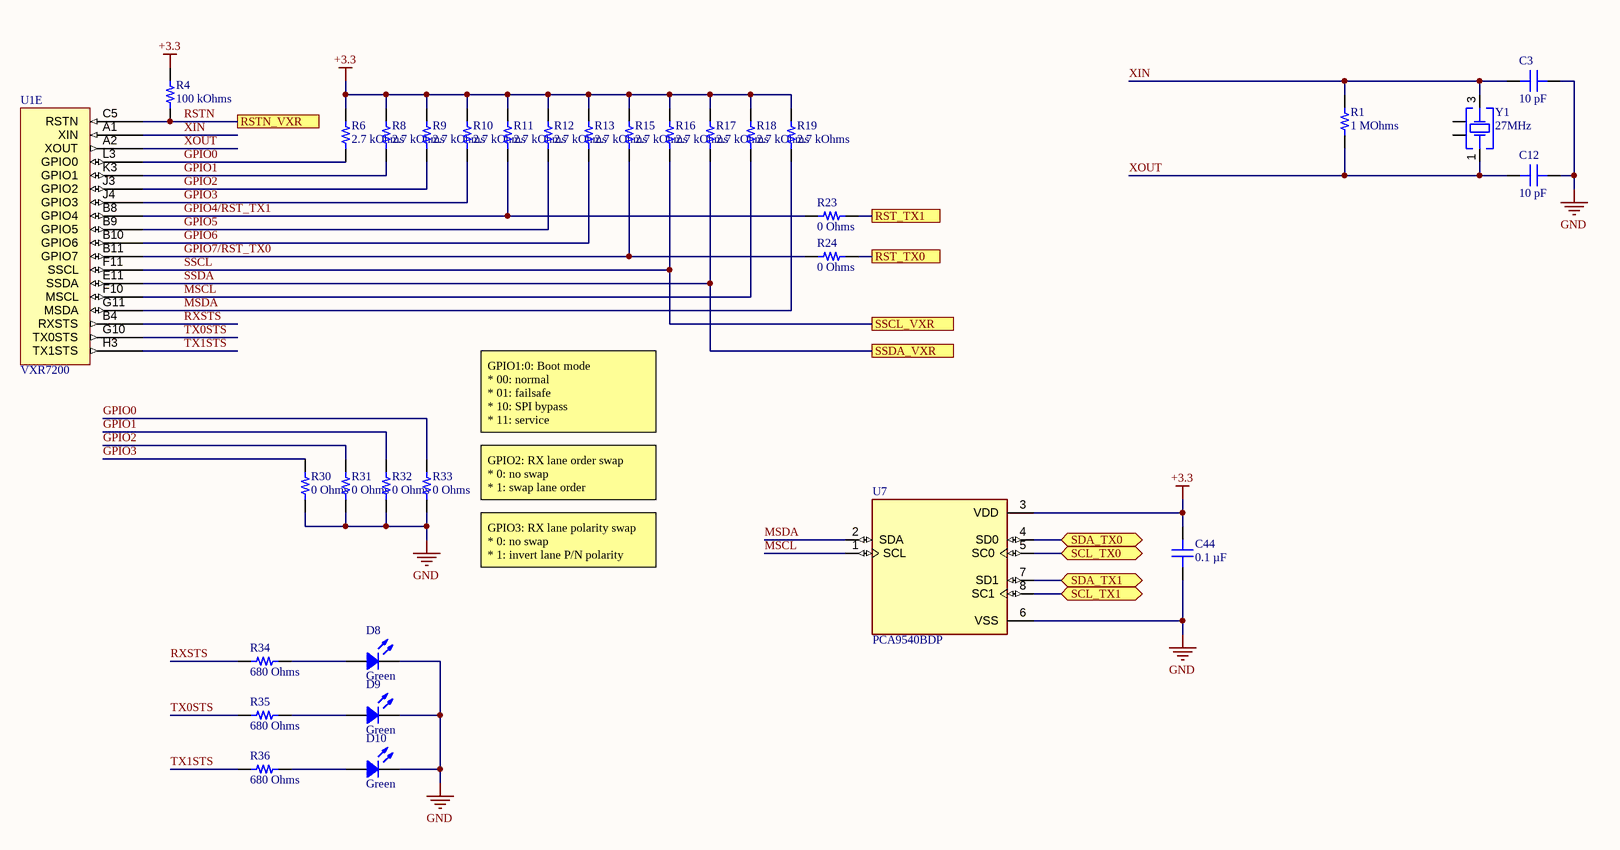
[diagram p4: Control.SchDoc]

### Parts
C3  10 pF  [CAP 0201_0603]
C12  10 pF  [CAP 0201_0603]
C44  0.1 µF  [CAP 0201_0603]
D8  Green  [LED 0603_1608 GREEN]
D9  Green  [LED 0603_1608 GREEN]
D10  Green  [LED 0603_1608 GREEN]
R1  1 MOhms  [RES 0201_0603]
R4  100 kOhms  [RES 0201_0603]
R6  2.7 kOhms  [RES 0201_0603]
R8  2.7 kOhms  [RES 0201_0603]
R9  2.7 kOhms  [RES 0201_0603]
R10  2.7 kOhms  [RES 0201_0603]
R11  2.7 kOhms  [RES 0201_0603]
R12  2.7 kOhms  [RES 0201_0603]
R13  2.7 kOhms  [RES 0201_0603]
R15  2.7 kOhms  [RES 0201_0603]
R16  2.7 kOhms  [RES 0201_0603]
R17  2.7 kOhms  [RES 0201_0603]
R18  2.7 kOhms  [RES 0201_0603]
R19  2.7 kOhms  [RES 0201_0603]
R23  0 Ohms  [RES 0402_1005]
R24  0 Ohms  [RES 0402_1005]
R30  0 Ohms  [RES 0402_1005]
R31  0 Ohms  [RES 0402_1005]
R32  0 Ohms  [RES 0402_1005]
R33  0 Ohms  [RES 0402_1005]
R34  680 Ohms  [RES 0402_1005]
R35  680 Ohms  [RES 0402_1005]
R36  680 Ohms  [RES 0402_1005]
U1  VXR7200  [BGA100P9X9-81A]  (part E of 9)
U7  PCA9540BDP  [SOP65P490X110-8N]
Y1  27MHz  [WE-XTAL_CFPX-218]

### Ports
RST_TX0, RST_TX1, RSTN_VXR, SCL_TX0 (bidir), SCL_TX1 (bidir), SDA_TX0 (bidir), SDA_TX1 (bidir), SSCL_VXR, SSDA_VXR

### Nets
+3.3: C44.2 R4.2 R6.2 R8.2 R9.2 R10.2 R11.2 R12.2 R13.2 R15.2 R16.2 R17.2 R18.2 R19.2 U7.3(VDD)
GND: C3.2 C12.2 C44.1 D8.2 D9.2 D10.2 R30.1 R31.1 R32.1 R33.1 U7.6(VSS)
GPIO0: R6.1 R33.2 U1.L3(GPIO0)
GPIO1: R8.1 R32.2 U1.K3(GPIO1)
GPIO2: R9.1 R31.2 U1.J3(GPIO2)
GPIO3: R10.1 R30.2 U1.J4(GPIO3)
GPIO4/RST_TX1: R11.1 R23.2 U1.B8(GPIO4)
GPIO5: R12.1 U1.B9(GPIO5)
GPIO6: R13.1 U1.B10(GPIO6)
GPIO7/RST_TX0: R15.1 R24.2 U1.B11(GPIO7)
MSCL: R18.1 U1.F10(MSCL) U7.1(SCL)
MSDA: R19.1 U1.G11(MSDA) U7.2(SDA)
RST_TX0: R24.1 ; port RST_TX0
RST_TX1: R23.1 ; port RST_TX1
RSTN: R4.1 U1.C5(RSTN) ; port RSTN_VXR
RXSTS: R34.1 U1.B4(RXSTS)
SCL_TX0: U7.5(SC0) ; port SCL_TX0
SCL_TX1: U7.8(SC1) ; port SCL_TX1
SDA_TX0: U7.4(SD0) ; port SDA_TX0
SDA_TX1: U7.7(SD1) ; port SDA_TX1
SSCL: R16.1 U1.F11(SSCL) ; port SSCL_VXR
SSDA: R17.1 U1.E11(SSDA) ; port SSDA_VXR
TX0STS: R35.1 U1.G10(TX0STS)
TX1STS: R36.1 U1.H3(TX1STS)
XIN: C3.1 R1.2 U1.A1(XIN) Y1.3(Crystal)
XOUT: C12.1 R1.1 U1.A2(XOUT) Y1.1(Crystal)
NetD8_1: D8.1 R34.2
NetD9_1: D9.1 R35.2
NetD10_1: D10.1 R36.2

Not connected (* = marked no-connect by the designer): Y1 2(GND) 4(GND)

### Notes on the sheet
- GPIO1:0: Boot mode
  * 00: normal
  * 01: failsafe
  * 10: SPI bypass
  * 11: service
- GPIO2: RX lane order swap
  * 0: no swap
  * 1: swap lane order
- GPIO3: RX lane polarity swap
  * 0: no swap
  * 1: invert lane P/N polarity
- DWG. NO.
- REV.
- SHT.
- REVISION
- DESCRIPTION
- DATE
- APPROVED
- ENG:
- APPROVALS
- PROJECT
- DSN:
- CHK:
- REFERENCE DOCUMENTS
- PROJECT REVISION:
- TITLE
- SimulaVR
- DOCUMENT REVISION:
- DESIGN ITEM:
- BOM:
- FAB DWG:
- PCB DWG:
- ASSY DWG:
- SCALE:
- SIZE
- B
- CAGE CODE
- FILE NAME
- DWG NO.
- SHEET
- OF
- REV

### Library data of the parts
C3 C12 = GRM0335C1E100JA01D: CAP CER 10PF 25V C0G/NP0 0201; manufacturer: Murata Electronics; Temperature Coefficient: C0G, NP0; Tolerance: ±5%; Part Number: GRM0335C1E100JA01D; Value: 10 pF; Applications: General Purpose; Capacitance: 10 pF; componentlink1description: Datasheet; componentlink1url: https://search.murata.co.jp/Ceramy/image/img/A01X/G101/ENG/GRM0335C1E100JA01-01.pdf; componentlink2description: DigiKey Link; componentlink2url: https://www.digikey.com/en/products/detail/murata-electronics/GRM0335C1E100JA01D/4358173; Device Package: 0201 (0603 Metric); lastupdated: 2022-04-12 22:02:08; Lifecycle Status: Active; Minimum Order: 1; Mounting Type: Surface Mount, MLCC; Operating Temperature: -55°C ~ 125°C; Package / Case: 0201 (0603 Metric); packaging: CutTape; partid: 180; Part Status: Active; price: 0.01; series: GRM; Size / Dimension: 0.024" L x 0.012" W (0.60mm x 0.30mm); Supplier 1: DigiKey; Supplier Part Number 1: 490-8607-1-ND; Thickness (Max): 0.013" (0.33mm); Voltage - Rated: 25V
C44 = GRM033R61E104KE14D: as C1 on sheet RX_DP; Part Number: GRM033R61E104KE14D; Value: 0.1 µF; Applications: General Purpose; Capacitance: 0.1 µF; componentlink1description: Datasheet; componentlink1url: https://search.murata.co.jp/Ceramy/image/img/A01X/G101/ENG/GRM033R61E104KE14-01.pdf; componentlink2description: DigiKey Link; componentlink2url: https://www.digikey.com/en/products/detail/murata-electronics/GRM033R61E104KE14D/4904731; Device Package: 0201 (0603 Metric); lastupdated: 5/20/2022 2:33:00 PM; Lifecycle Status: Active; Minimum Order: 1; Mounting Type: Surface Mount; Operating Temperature: -55°C ~ 85°C; Package / Case: 0201 (0603 Metric); packaging: TapeAndReel; partid: 39731; Part Status: Active; price: 0.01; series: GRM; Size / Dimension: 0.024" L x 0.012" W (0.60mm x 0.30mm); Supplier 1: DigiKey; Supplier Part Number 1: 490-12686-1-ND; Temperature Coefficient: X5R; Thickness (Max): 0.013" (0.33mm); Voltage - Rated: 25V
D8-D10 = 150060GS55040: LED GREEN DIFFUSED 0603 SMD; Manufacturer: Würth Elektronik; Configuration: Standard; Current - Test: 20mA; Lens Color: 0.50mm; Lens Size: 1.00mm x 0.80mm; Lens Style: Rectangle with Flat Top; Millicandela Rating: 430mcd; Viewing Angle: 140°; Voltage - Forward (Vf) (Typ): 3.2V; Wavelength - Dominant: 525nm; Wavelength - Peak: 520nm; Part Number: 150060GS55040; Color: Green; ComponentLink1Description: Datasheet; ComponentLink1URL: https://www.we-online.de/web/en/index.php/download/media/07_electronic_components/download_center_1/application_notes_berichte/ano002_leds___the_future_of_horticultural_lighting/ANO002b_EN_LEDs_The_Future_of_Horticultural_Lighting.pdf; ComponentLink2Description: DigiKey Link; ComponentLink2URL: https://www.digikey.com/en/products/detail/würth-elektronik/150060GS55040/8557179; Device Package: 0603 (1608 Metric); Height (Max): 0.50mm; LastUpdated: 2022-04-12 22:51:58; Lens Transparency: Diffused; Lifecycle Status: Active; Minimum Order: 1; Mounting Type: Surface Mount; Package / Case: 0603 (1608 Metric); Packaging: TapeAndReel; PartId: 673; Part Status: Active; Price: 0.13; Series: WL-SMDC; Size / Dimension: 1.60mm L x 0.80mm W; Supplier 1: DigiKey; Supplier Part Number 1: 732-12014-1-ND; Supplier Device Package: 0603 (1608 Metric); Value: Green
R1 = CRCW02011M00FKED: as R42 on sheet RX_DP; Part Number: CRCW02011M00FKED; Value: 1 MOhms; ComponentLink1Description: Datasheet; ComponentLink1URL: http://www.vishay.com/docs/20052/crcw0201e3.pdf; ComponentLink2Description: DigiKey Link; ComponentLink2URL: https://www.digikey.com/en/products/detail/vishay-dale/CRCW02011M00FKED/1968003; Composition: Thick Film; Device Package: 0201 (0603 Metric); Height - Seated (Max): 0.010" (0.26mm); LastUpdated: 2022-04-12 22:16:01; Lifecycle Status: Active; Minimum Order: 1; Number of Terminations: 2; Operating Temperature: -55°C ~ 155°C; Package / Case: 0201 (0603 Metric); Packaging: TapeAndReel; PartId: 30; Part Status: Active; Price: 0.03; Resistance: 1 MOhms; Series: CRCW; Size / Dimension: 0.024" L x 0.012" W (0.60mm x 0.30mm); Supplier 1: DigiKey; Supplier Part Number 1: 541-1.00MAABCT-ND; Supplier Device Package: 0201; Tolerance: ±1%
R4 = ERJ-U01F1003C: as R46 on sheet RX_DP; Part Number: ERJ-U01F1003C; Value: 100 kOhms; ComponentLink1Description: Datasheet; ComponentLink1URL: https://industrial.panasonic.com/cdbs/www-data/pdf/RDP0000/AOA0000C334.pdf; ComponentLink2Description: DigiKey Link; ComponentLink2URL: https://www.digikey.com/en/products/detail/panasonic-electronic-components/ERJ-U01F1003C/11631500; Composition: Thick Film; Device Package: 0201 (0603 Metric); Features: Anti-Sulfur; Height - Seated (Max): 0.010" (0.26mm); LastUpdated: 2022-04-12 22:15:26; Lifecycle Status: Active; Minimum Order: 1; Number of Terminations: 2; Operating Temperature: -55°C ~ 125°C; Package / Case: 0201 (0603 Metric); Packaging: TapeAndReel; PartId: 64617; Part Status: Active; Price: 0.05; Resistance: 100 kOhms; Series: ERJ-U01; Size / Dimension: 0.024" L x 0.012" W (0.60mm x 0.30mm); Supplier 1: DigiKey; Supplier Part Number 1: 10-ERJ-U01F1003CCT-ND; Supplier Device Package: 0201; Tolerance: ±1%
R6 R8-R13 R15-R19 = ERJ-U01J272C: as R2 on sheet TX0; Part Number: ERJ-U01J272C; Value: 2.7 kOhms; ComponentLink1Description: Datasheet; ComponentLink1URL: https://industrial.panasonic.com/cdbs/www-data/pdf/RDP0000/AOA0000C334.pdf; ComponentLink2Description: DigiKey Link; ComponentLink2URL: https://www.digikey.com/en/products/detail/panasonic-electronic-components/ERJ-U01J272C/11641374; Composition: Thick Film; Device Package: 0201 (0603 Metric); Features: Anti-Sulfur; Height - Seated (Max): 0.010" (0.26mm); LastUpdated: 2022-04-12 22:15:26; Lifecycle Status: Active; Minimum Order: 1; Number of Terminations: 2; Operating Temperature: -55°C ~ 125°C; Package / Case: 0201 (0603 Metric); Packaging: TapeAndReel; PartId: 64645; Part Status: Active; Price: 0.04; Resistance: 2.7 kOhms; Series: ERJ-U01; Size / Dimension: 0.024" L x 0.012" W (0.60mm x 0.30mm); Supplier 1: DigiKey; Supplier Part Number 1: 10-ERJ-U01J272CCT-ND; Supplier Device Package: 0201; Tolerance: ±5%
R23 R24 R30-R33 = AC0402FR-070RL: as R25 on sheet TX0; Part Number: AC0402FR-070RL; Value: 0 Ohms; ComponentLink1Description: Datasheet; ComponentLink1URL: https://www.yageo.com/upload/media/product/productsearch/datasheet/rchip/PYu-AC_51_RoHS_L_8.pdf; ComponentLink2Description: DigiKey Link; ComponentLink2URL: https://www.digikey.com/en/products/detail/yageo/AC0402FR-070RL/12082398; Composition: Thick Film; Device Package: 0402 (1005 Metric); Features: Automotive AEC-Q200, Moisture Resistant; Height - Seated (Max): 0.015" (0.37mm); LastUpdated: 2022-04-12 22:19:37; Lifecycle Status: Active; Minimum Order: 1; Number of Terminations: 2; Operating Temperature: -55°C ~ 155°C; Package / Case: 0402 (1005 Metric); Packaging: CutTape; PartId: 66976; Part Status: Active; Price: 0.01; Ratings: AEC-Q200; Resistance: 0 Ohms; Series: AC; Size / Dimension: 0.039" L x 0.020" W (1.00mm x 0.50mm); Supplier 1: DigiKey; Supplier Part Number 1: 13-AC0402FR-070RLCT-ND; Supplier Device Package: 0402; Tolerance: Jumper
R34-R36 = RCS0402680RFKED: RES SMD 680 OHM 1% 1/5W 0402; Manufacturer: Vishay Dale; Power (Watts): 0.2W, 1/5W; Temperature Coefficient: ±100ppm/°C; Part Number: RCS0402680RFKED; Value: 680 Ohms; ComponentLink1Description: Datasheet; ComponentLink1URL: http://www.vishay.com/docs/20065/rcse3.pdf; ComponentLink2Description: DigiKey Link; ComponentLink2URL: https://www.digikey.com/en/products/detail/vishay-dale/RCS0402680RFKED/5867679; Composition: Thick Film; Device Package: 0402 (1005 Metric); Features: Automotive AEC-Q200, Pulse Withstanding; Height - Seated (Max): 0.016" (0.40mm); LastUpdated: 2022-04-12 22:21:08; Lifecycle Status: Active; Minimum Order: 1; Number of Terminations: 2; Operating Temperature: -55°C ~ 155°C; Package / Case: 0402 (1005 Metric); Packaging: TapeAndReel; PartId: 6056; Part Status: Active; Price: 0.01; Ratings: AEC-Q200; Resistance: 680 Ohms; Series: RCS e3; Size / Dimension: 0.039" L x 0.020" W (1.00mm x 0.50mm); Supplier 1: DigiKey; Supplier Part Number 1: 541-10420-1-ND; Supplier Device Package: 0402; Tolerance: ±1%
U1 = CMP-015-00008-4: VXR7200 DP to MIPI-DSI bridge
U7 = PCA9540BDP: 2-Channel IﾂｲC Multiplexer Interface 8-TSSOP; MF: {'manufacturer': u'NXP USA'}; Price: None; Value: *; Package: None; MP: PCA9540BDP; Availability: Unavailable
Y1 = 830108208409: WE-XTAL Quartz Crystal, SMT, CFPX-218, 27MHz, +/-10ppm; Manufacturer: Wurth Elektronik; Load Capacitance: 10pF; ComponentLink1Description: Manufacturer; ComponentLink1URL: http://www.we-online.de; ComponentLink2Description: Datasheet; ComponentLink2URL: https://katalog.we-online.com/pbs/datasheet/830108208409.pdf; Operating Temperature: -20 to +70degC; Packaging: Tape and Reel; Manufacturer Part Number: 830108208409; Published Date: July 2020; Size: CFPX-218; Frequency Stability: +/-10ppm; Frequency: 27MHz; Frequency Tolerance: +/-10ppm; Mounting Technology: SMT